# EAGLE schematic schema (EAGLE 9.5.2)
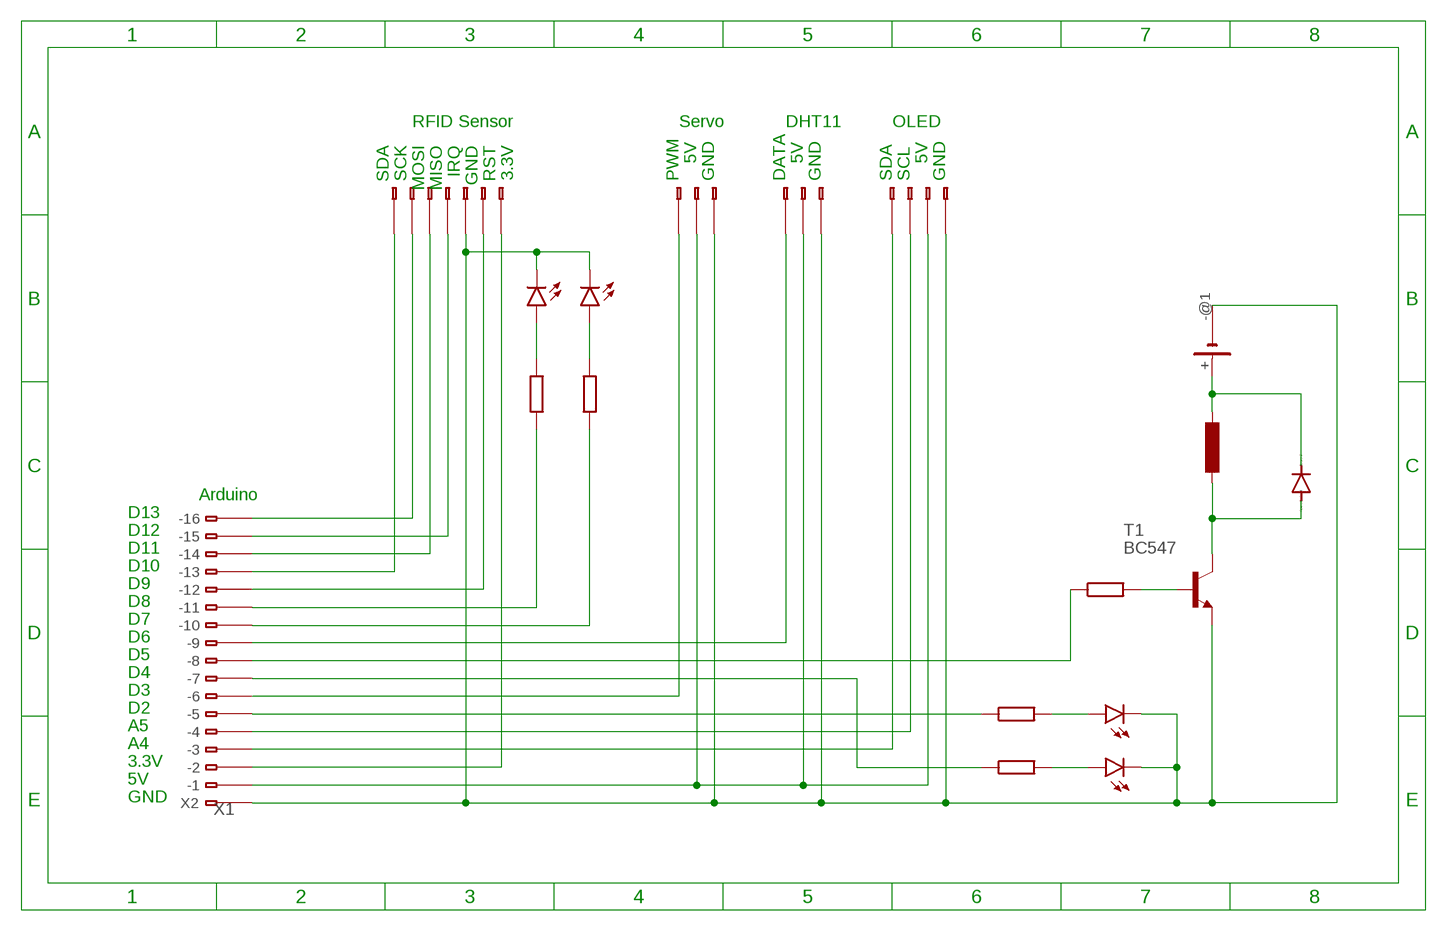
[diagram p0: schematic, sheet 1]

## Parts
D4  1N4148DO35-7  [DO35-7]
G1  CR2/3  [CR2/3]
LED1  LED5MM  [LED5MM]
LED2  LED5MM  [LED5MM]
LED3  LED5MM  [LED5MM]
LED4  LED5MM  [LED5MM]
T1  BC547  [TO92]
X1  233-116  [233-116]
X2  WAGO1255-401-5  [255-401-5]
X3  WAGO7-233-107  [233-107]
X4  WAGO3-233-103  [233-103]
X5  WAGO3-233-103  [233-103]
X6  WAGO4-233-104  [233-104]

## Nets
N$1: G1.-@1(-) LED1.K(C) LED2.K(C) LED3.K(C) LED4.K(C) T1.1(E) X2.B1 X3.B5(-5:B1) X4.B3(-3:B1) X5.B3(-3:B1) X6.B4(-4:B1)
N$2: X1.B5(B-5)
N$3: X1.B8(B-8)
N$5: D4.A T1.3(C)
N$6: D4.C G1.+
N$7: T1.2(B)
N$8: X1.B13(B-13) X3.B1(-1:B1)
N$9: X1.B16(B-16) X3.B2(-2:B1)
N$10: X1.B14(B-14) X3.B3(-3:B1)
N$11: X1.B15(B-15) X3.B4(-4:B1)
N$12: X1.B12(B-12) X3.B6(-6:B1)
N$13: X1.B2(B-2) X3.B7(-7:B1)
N$14: X1.B11(B-11)
N$15: X1.B10(B-10)
N$16: LED1.A
N$17: LED2.A
N$18: X1.B1(B-1) X4.B2(-2:B1) X5.B2(-2:B1) X6.B3(-3:B1)
N$19: X1.B6(B-6) X4.B1(-1:B1)
N$20: X1.B9(B-9) X5.B1(-1:B1)
N$21: LED3.A
N$22: LED4.A
N$23: X1.B7(B-7)
N$24: X1.B3(B-3) X6.B1(-1:B1)
N$25: X1.B4(B-4) X6.B2(-2:B1)
Unconnected: G1.-@2(-) X1.A1(-1) X1.A2(-2) X1.A3(-3) X1.A4(-4) X1.A5(-5) X1.A6(-6) X1.A7(-7) X1.A8(-8) X1.A9(-9) X1.A10(-10) X1.A11(-11) X1.A12(-12) X1.A13(-13) X1.A14(-14) X1.A15(-15) X1.A16(-16) X2.A1 X3.A1(-1:A1) X3.A2(-2:A1) X3.A3(-3:A1) X3.A4(-4:A1) X3.A5(-5:A1) X3.A6(-6:A1) X3.A7(-7:A1) X4.A1(-1:A1) X4.A2(-2:A1) X4.A3(-3:A1) X5.A1(-1:A1) X5.A2(-2:A1) X5.A3(-3:A1) X6.A1(-1:A1) X6.A2(-2:A1) X6.A3(-3:A1) X6.A4(-4:A1)

## Notes on the sheet
- RFID Sensor | Servo | DHT11 | OLED
- SDA | SCK | MOSI | MISO | IRQ | GND | RST | 3.3V
- 5V | 5V | 5V
- PWM | GND | DATA | GND | SDA | SCL | GND
- Arduino
- D13
- D12
- D11
- D10
- D9
- D8
- D7
- D6
- D5
- D4
- D3
- D2
- A5
- A4
- 3.3V
- 5V
- GND

## Library data of the parts
D4 = diode:1N4148: DIODE high speed (Philips)
G1 = battery:CR2/3: LI BATTERY Sonnenschein SL-361 PT
LED1-LED4 = led:LED: LED OSRAM: - CHIPLED LG R971, LG N971, LY N971, LG Q971, LY Q971, LO R971, LY R971 LH N974, LH R974 LS Q976, LO Q976, LY Q976 LO Q996 - Hyper CHIPLED LW Q18S LB Q993, LB Q99A, LB R99A - SideLED LS A670, LO A670, LY A670, LG A670, LP A670 LB A673, LV A673, LT A673, LW A673 LH A674 LY A675 LS A676, LA A676, LO A676, LY A676, LW A676 LS A679, LY A679, LG A679 - Hyper Micro SIDELED® LS Y876, LA Y876, LO Y876, LY Y876 LT Y87S - SmartLED LW L88C, LW L88S LB L89C, LB L89S, LG L890 LS L89K, LO L89K, LY L89K LS L896, LA L896, LO L896, LY L896 - TOPLED LS T670, LO T670, LY T670, LG T670, LP T670 LSG T670, LSP T670, LSY T670, LOP T670, LYG T670 LG T671, LOG T671, LSG T671 LB T673, LV T673, LT T673, LW T673 LH T674 LS T676, LA T676, LO T676, LY T676, LB T676, LH T676, LSB T676, LW T676 LB T67C, LV T67C, LT T67C, LS T67K, LO T67K, LY T67K, LW E67C LS E67B, LA E67B, LO E67B, LY E67B, LB E67C, LV E67C, LT E67C LW T67C LS T679, LY T679, LG T679 LS T770, LO T770, LY T770, LG T770, LP T770 LB T773, LV T773, LT T773, LW T773 LH T774 LS E675, LA E675, LY E675, LS T675 LS T776, LA T776, LO T776, LY T776, LB T776 LHGB T686 LT T68C, LB T68C - Hyper Mini TOPLED® LB M676 - Mini TOPLED Santana® LG M470 LS M47K, LO M47K, LY M47K Source: http://www.osram.convergy.de LUXEON: - LUMILED® LXK2-PW12-R00, LXK2-PW12-S00, LXK2-PW14-U00, LXK2-PW14-V00 LXK2-PM12-R00, LXK2-PM12-S00, LXK2-PM14-U00 LXK2-PE12-Q00, LXK2-PE12-R00, LXK2-PE12-S00, LXK2-PE14-T00, LXK2-PE14-U00 LXK2-PB12-K00, LXK2-PB12-L00, LXK2-PB12-M00, LXK2-PB14-N00, LXK2-PB14-P00, LXK2-PB14-Q00 LXK2-PR12-L00, LXK2-PR12-M00, LXK2-PR14-Q00, LXK2-PR14-R00 LXK2-PD12-Q00, LXK2-PD12-R00, LXK2-PD12-S00 LXK2-PH12-R00, LXK2-PH12-S00 LXK2-PL12-P00, LXK2-PL12-Q00, LXK2-PL12-R00 Source: www.luxeon.com KINGBRIGHT: KA-3528ASYC Source: www.kingbright.com
T1 = transistor:BC547: NPN TRANSISTOR
X1 = con-wago:233-116: WAGO Cage Clamp; MPN: 233-116; OC_FARNELL: unknown; OC_NEWARK: 28K9054
X2 = con-wago:WAGO1: WAGO Cage Clamp; MPN: 255-401; OC_FARNELL: 4015319; OC_NEWARK: 28K9763
X3 = con-wago:WAGO7-: WAGO Cage Clamp; MPN: 233-107; OC_FARNELL: unknown; OC_NEWARK: 28K9049
X4 X5 = con-wago:WAGO3-: WAGO Cage Clamp; MPN: 233-103; OC_FARNELL: unknown; OC_NEWARK: 28K9045
X6 = con-wago:WAGO4-: WAGO Cage Clamp; MPN: 233-104; OC_FARNELL: unknown; OC_NEWARK: 28K9046